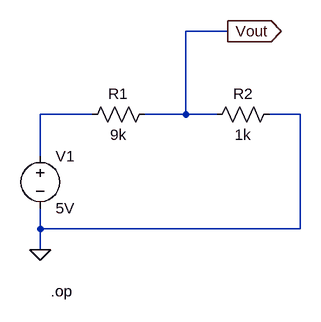
[diagram p0: schematic E1 Loading a Divider.asc]
E1 Loading a Divider.asc, the LTspice schematic file:
Version 4
SHEET 1 880 680
WIRE 320 -80 256 -80
WIRE 112 48 32 48
WIRE 256 48 256 -80
WIRE 256 48 192 48
WIRE 304 48 256 48
WIRE 432 48 384 48
WIRE 32 112 32 48
WIRE 32 224 32 192
WIRE 432 224 432 48
WIRE 432 224 32 224
WIRE 32 256 32 224
FLAG 32 256 0
FLAG 320 -80 Vout
IOPIN 320 -80 Out
SYMBOL voltage 32 96 R0
WINDOW 123 0 0 Left 0
WINDOW 39 0 0 Left 0
SYMATTR InstName V1
SYMATTR Value 5V
SYMBOL res 208 32 R90
WINDOW 0 0 56 VBottom 2
WINDOW 3 32 56 VTop 2
SYMATTR InstName R1
SYMATTR Value 9k
SYMBOL res 400 32 R90
WINDOW 0 0 56 VBottom 2
WINDOW 3 32 56 VTop 2
SYMATTR InstName R2
SYMATTR Value 1k
TEXT 48 320 Left 2 !.op

The netlist it stands for:
* E1 Loading a Divider.asc
V1 N001 0 5V
R1 Vout N001 9k
R2 0 Vout 1k
.op
.backanno
.end